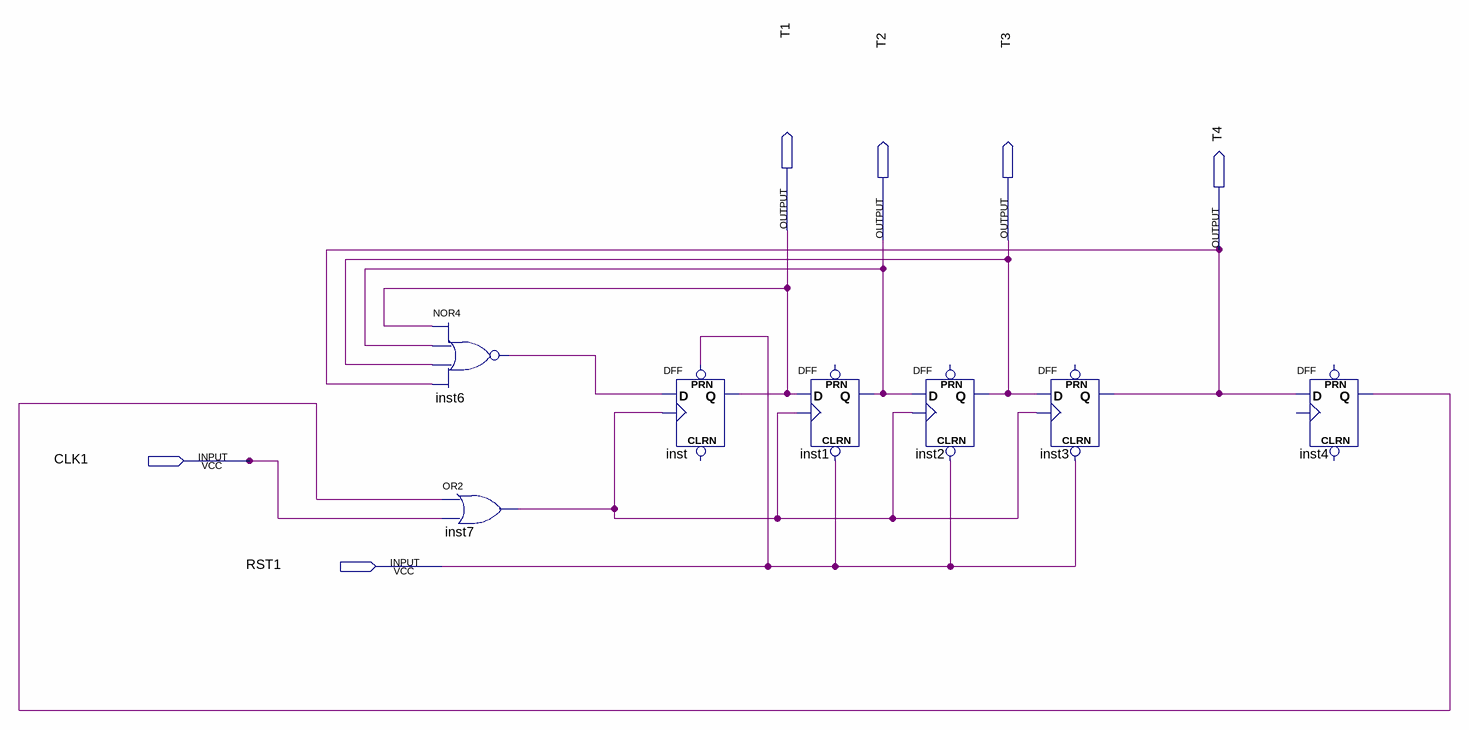
[diagram p0: schematic sheet]
// Quartus schematic TASK2.bdf as structural Verilog: 7 symbols, 6 pins
module TASK2 (
  input  CLK1,
  input  RST1,
  output T1,
  output T2,
  output T3,
  output T4
);

  wire inst4_q, inst6_out, inst7_out;

  nor inst6 (inst6_out, T1, T2, T3, T4);
  or inst7 (inst7_out, inst4_q, CLK1);
  DFF inst (.CLK(inst7_out), .D(inst6_out), .PRN(RST1), .Q(T1));  // open: CLRN
  DFF inst1 (.CLRN(RST1), .CLK(inst7_out), .D(T1), .Q(T2));  // open: PRN
  DFF inst2 (.CLRN(RST1), .CLK(inst7_out), .D(T2), .Q(T3));  // open: PRN
  DFF inst3 (.CLRN(RST1), .CLK(inst7_out), .D(T3), .Q(T4));  // open: PRN
  DFF inst4 (.D(T4), .Q(inst4_q));  // open: CLRN, CLK, PRN
endmodule
